# Altium schematic sheet LED.SchDoc
size A
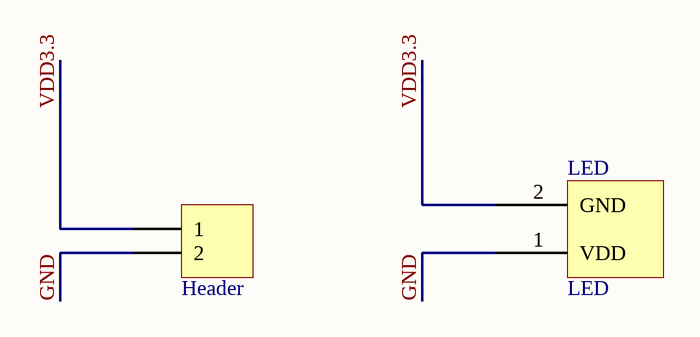
[diagram p0: LED.SchDoc]

## Parts
?  Header  [HDR1X2]
LED  LED  [LED]

## Nets
GND: ?.2 LED.1(VDD)
VDD3.3: ?.1 LED.2(GND)

## Library data of the parts
? = Header 2: Header, 2-Pin; LatestRevisionDate: 17-Jul-2002; LatestRevisionNote: Re-released for DXP Platform.; Publisher: Altium Limited
LED = Component_1